# Altium schematic sheet PowerSupply.SchDoc: POLYSOME CRYPTO 01
size A3; Revision: V1; SheetNumber: 8; SheetTotal: 8; ProjectName: POLYSOME CRYPTO 01
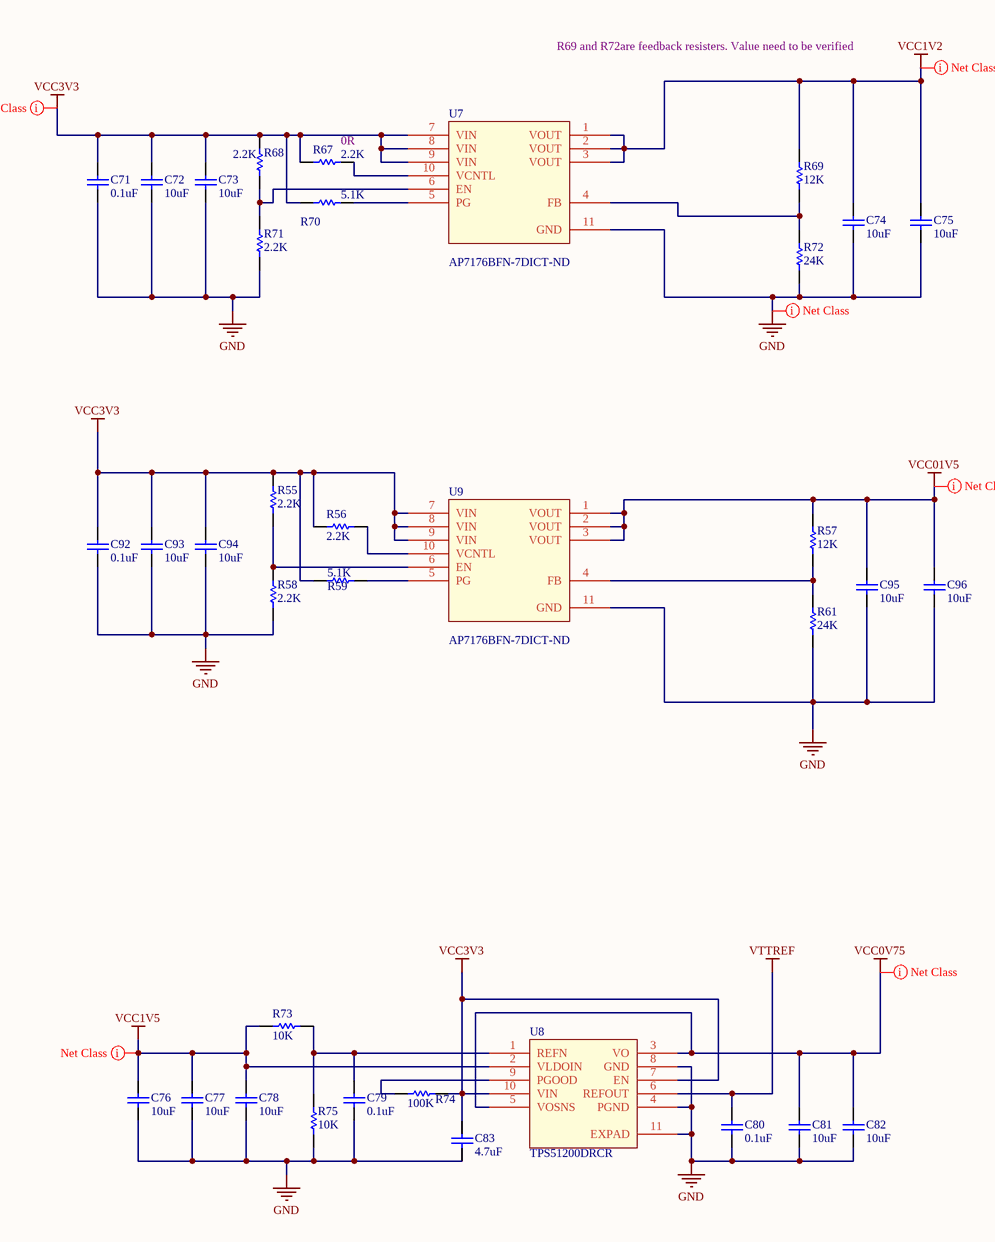
[diagram p0: PowerSupply.SchDoc]

## Parts
C71  value 0.1uF  [0402]  (hidden comment: Cap Semi)
C72  value 10uF  [1608[0603]]  (hidden comment: Cap Semi)
C73  value 10uF  [1608[0603]]  (hidden comment: Cap Semi)
C74  value 10uF  [C0805]  (hidden comment: Cap Semi)
C75  value 10uF  [C0805]  (hidden comment: Cap Semi)
C76  value 10uF  [1608[0603]]  (hidden comment: Cap Semi)
C77  value 10uF  [1608[0603]]  (hidden comment: Cap Semi)
C78  value 10uF  [0402]  (hidden comment: Cap Semi)
C79  value 0.1uF  [0402]  (hidden comment: Cap Semi)
C80  value 0.1uF  [0402]  (hidden comment: Cap Semi)
C81  value 10uF  [0402]  (hidden comment: Cap Semi)
C82  value 10uF  [C0805]  (hidden comment: Cap Semi)
C83  value 4.7uF  [0402]  (hidden comment: Cap Semi)
C92  value 0.1uF  [0402]  (hidden comment: Cap)
C93  value 10uF  [1608[0603]]  (hidden comment: Cap)
C94  value 10uF  [1608[0603]]  (hidden comment: Cap)
C95  value 10uF  [1608[0603]]  (hidden comment: Cap)
C96  value 10uF  [1608[0603]]  (hidden comment: Cap)
R55  value 2.2K  [0402]  (hidden comment: Res Semi)
R56  value 2.2K  [0402]  (hidden comment: Res Semi)
R57  value 12K  [0402]  (hidden comment: Res Semi)
R58  value 2.2K  [0402]  (hidden comment: Res Semi)
R59  value 5.1K  [0402]  (hidden comment: Res Semi)
R61  value 24K  [0402]  (hidden comment: Res Semi)
R67  value 2.2K  [0402]  (hidden comment: Res Semi)
R68  value 2.2K  [0402]  (hidden comment: Res Semi)
R69  value 12K  [0402]  (hidden comment: Res Semi)
R70  value 5.1K  [0402]  (hidden comment: Res Semi)
R71  value 2.2K  [0402]  (hidden comment: Res Semi)
R72  value 24K  [0402]  (hidden comment: Res Semi)
R73  value 10K  [0402]  (hidden comment: Res Semi)
R74  value 100K  [0402]  (hidden comment: Res Semi)
R75  value 10K  [0402]  (hidden comment: Res Semi)
U7  AP7176BFN-7DICT-ND  [PSON50P300X100_HS-11N]
U8  TPS51200DRCR  [PSON50P300X100_HS-11N]
U9  AP7176BFN-7DICT-ND  [PSON50P300X100_HS-11N]

## Nets
GND: C71.2 C72.2 C73.2 C74.2 C75.2 C76.2 C77.2 C78.2 C79.2 C80.2 C81.2 C82.2 C83.2 C92.1 C93.1 C94.1 C95.1 C96.1 R58.1 R61.1 R71.1 R72.1 R75.1 U7.11(GND) U8.4(PGND) U8.8(GND) U8.11(EXPAD) U9.11(GND)
VCC0V75: C81.1 C82.1 U8.3(VO) U8.5(VOSNS)
VCC1V2: C74.1 C75.1 R69.2 U7.1(VOUT) U7.2(VOUT) U7.3(VOUT)
VCC1V5: C76.1 C77.1 C78.1 R73.1 U8.2(VLDOIN)
VCC01V5: C95.2 C96.2 R57.2 U9.1(VOUT) U9.2(VOUT) U9.3(VOUT)
VCC3V3: C71.1 C72.1 C73.1 C83.1 C92.2 C93.2 C94.2 R55.2 R56.2 R59.2 R67.1 R68.2 R70.1 R74.2 U7.7(VIN) U7.8(VIN) U7.9(VIN) U8.7(EN) U8.10(VIN) U9.7(VIN) U9.8(VIN) U9.9(VIN)
VTTREF: C80.1 U8.6(REFOUT)
NetC79_1: C79.1 R73.2 R75.2 U8.1(REFN)
NetR55_1: R55.1 R58.2 U9.6(EN)
NetR56_1: R56.1 U9.10(VCNTL)
NetR57_1: R57.1 R61.2 U9.4(FB)
NetR59_1: R59.1 U9.5(PG)
NetR67_2: R67.2 U7.10(VCNTL)
NetR68_1: R68.1 R71.2 U7.6(EN)
NetR69_1: R69.1 R72.2 U7.4(FB)
NetR70_2: R70.2 U7.5(PG)
NetR74_1: R74.1 U8.9(PGOOD)

## Layout directives
net class VCC1V2: VCC1V2
net class VCC0V75: VCC0V75
net class VCC1V5: VCC1V5
net class VCC3V3: VCC3V3
net class GND: GND
net class VCCO1V5: VCC01V5

## Notes on the sheet
- R69 and R72are feedback resisters. Value need to be verified
- (near R67) 0R

## Library data of the parts
C71-C83 = Cap Semi: Capacitor (Semiconductor SIM Model); Published: 8-Jun-2000; LatestRevisionDate: 29-May-2009; LatestRevisionNote: IPC-7351 Footprint Added.; PackageReference: C1206; Publisher: Altium Limited; PackageDescription: Chip Capacitor
C92-C96 = Cap: Capacitor; Published: 8-Jun-2000; LatestRevisionDate: 17-Jul-2002; LatestRevisionNote: Re-released for DXP Platform.; PackageReference: RAD-0.3; Publisher: Altium Limited; PackageDescription: Radial Cap, Thru-Hole; 2 Leads; 0.3 in Pin Spacing
R55-R59 R61 R67-R75 = Res Semi: Semiconductor Resistor; Published: 8-Jun-2000; LatestRevisionDate: 17-Jul-2002; LatestRevisionNote: Re-released for DXP Platform.; PackageReference: AXIAL-0.5; Publisher: Altium Limited; PackageDescription: Axial Device, Thru-Hole; 2 Leads; 0.5 in Pin Spacing
U7 U9 = AP7176BFN-7: IC REG LDO ADJ 3A 10-DFN; Manufacturer: Diodes Incorporated; Regulator Topology: Positive Adjustable; Voltage - Output: 0.8 V ~ 5.17 V; Voltage - Dropout (Typical): 0.33V @ 3A; Number of Regulators: 1; Voltage - Input: 1.2 V ~ 3.65 V; Current - Limit (Min): 4.5A; Supplier 1: Digi-Key; Manufacturer Part Number: AP7176BFN-7; RoHS: RoHS Compliant; Category: Integrated Circuits (ICs); Stock 1: 8535; Pricing 1: 1=0.99, 10=0.877, 25=0.792, 100=0.693, 250=0.60776, 500=0.539, 1000=0.42625 (USD); Packaging: Cut Tape (CT); Current - Output: 3A; Operating Temperature: -40°C ~ 85°C; Mounting Type: Surface Mount; Package / Case: 10-UFDFN Exposed Pad; Supplier Device Package: 10-UDFN (3x3); ComponentLink1URL: http://diodes.com/datasheets/AP7176B.pdf; ComponentLink1Description: http://diodes.com/datasheets/AP7176B.pdf; Supplier Part Number 1: AP7176BFN-7DICT-ND
U8 = TPS51200DRCR: IC CONV DDR DDR2 DDR3 10SON; Manufacturer: Texas Instruments; Voltage - Input: 2.38 V ~ 3.5 V; Number of Outputs: 1; Supplier 1: Digi-Key; Manufacturer Part Number: TPS51200DRCR; RoHS: RoHS Compliant; Category: Integrated Circuits (ICs); Stock 1: 49935; Pricing 1: 1=2.15, 10=1.944, 25=1.7416, 100=1.566, 250=1.39052, 500=1.215, 750=1.10025, 1000=0.84375 (USD); Packaging: Cut Tape (CT); Applications: Converter, DDR; Voltage - Output: -; Operating Temperature: -40°C ~ 85°C; Mounting Type: Surface Mount; Package / Case: 10-VFDFN Exposed Pad; Supplier Device Package: 10-VSON (3x3); ComponentLink1URL: http://www.ti.com/lit/ds/symlink/tps51200.pdf; ComponentLink1Description: http://www.ti.com/lit/ds/symlink/tps51200.pdf; Supplier Part Number 1: 296-26978-1-ND